# EAGLE schematic Reaktionstester_SCH (EAGLE 9.5.0)
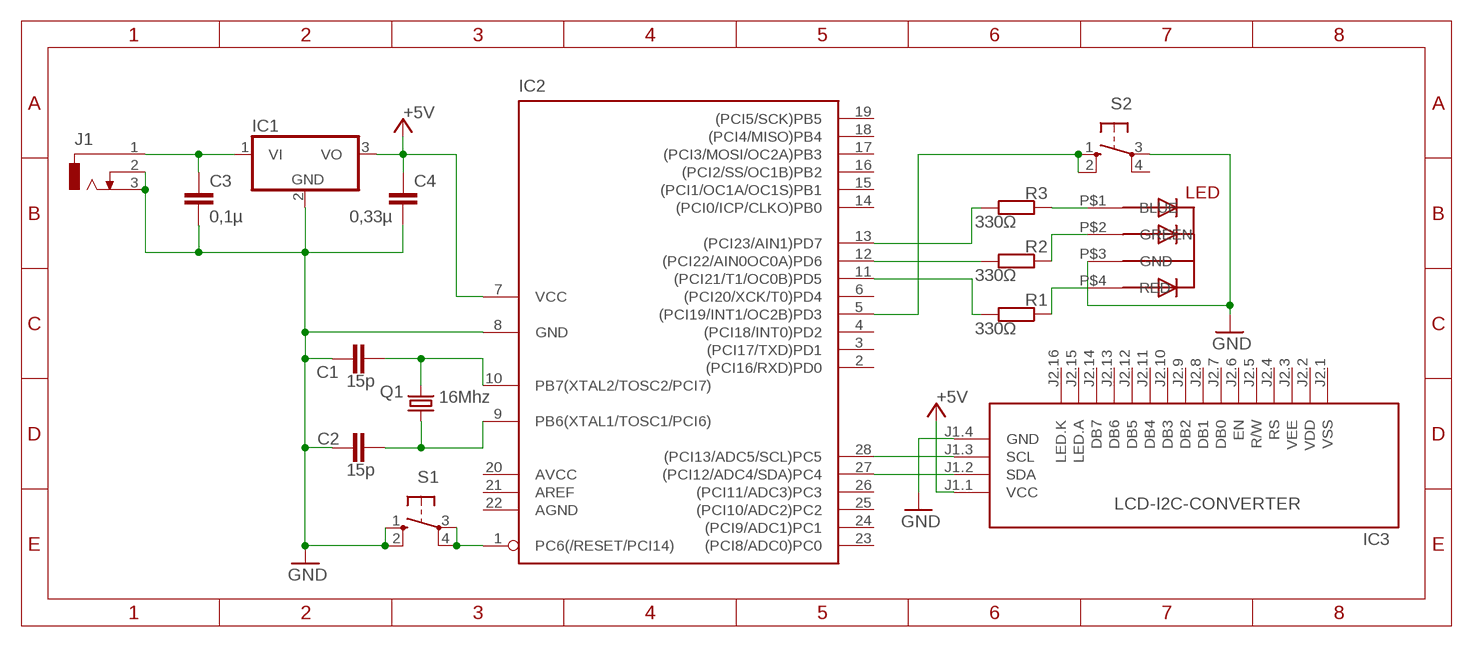
[diagram p0: schematic, sheet 1]

## Parts
C1  15p  C5/3.5  [C5B3.5]
C2  15p  C5/3.5  [C5B3.5]
C3  0,1µ  C-EU025-024X044  [C025-024X044]
C4  0,33µ  C-EU025-024X044  [C025-024X044]
IC1  7805T  [TO220H]
IC2  ATMEGA328-20P  [DIL28-3]
IC3  LCD-I2C-CONVERTER  [LCD-I2C-CONVERTER]
J1  DCJ0202  [DCJ0202]
LED  5MMRGBLED  [LED5MMRGB]
Q1  16Mhz  KX-K  [11.4X4.5]
R1  330Ω  R-EU_0204/5  [0204/5]
R2  330Ω  R-EU_0204/5  [0204/5]
R3  330Ω  R-EU_0204/5  [0204/5]
S1  10-XX  [B3F-10XX]
S2  10-XX  [B3F-10XX]

## Nets
+5V: C4.1 IC1.3(VO) IC2.7(VCC) IC3.J1.1(VCC)
GND: C1.1 C2.1 C3.2 C4.2 IC1.2(GND) IC2.8(GND) IC3.J1.4(GND) J1.2 J1.3 LED.P$3(GND) S1.1(S) S1.2(S1) S2.3(P) S2.4(P1)
N$1: C1.2 IC2.10(PB7(XTAL2/TOSC2/PCI7)) Q1.2
N$2: LED.P$1(BLUE) R3.1
N$3: C2.2 IC2.9(PB6(XTAL1/TOSC1/PCI6)) Q1.1
N$4: IC2.11((PCI21/T1/OC0B)PD5) R1.2
N$5: IC2.5((PCI19/INT1/OC2B)PD3) S2.1(S) S2.2(S1)
N$6: IC2.12((PCI22/AIN0OC0A)PD6) R2.2
N$7: IC2.13((PCI23/AIN1)PD7) R3.2
N$8: C3.1 IC1.1(VI) J1.1
N$9: LED.P$2(GREEN) R2.1
N$10: LED.P$4(RED) R1.1
N$11: IC2.28((PCI13/ADC5/SCL)PC5) IC3.J1.3(SCL)
N$12: IC2.1(PC6(/RESET/PCI14)) S1.3(P) S1.4(P1)
N$17: IC2.27((PCI12/ADC4/SDA)PC4) IC3.J1.2(SDA)
Unconnected: IC2.2((PCI16/RXD)PD0) IC2.3((PCI17/TXD)PD1) IC2.4((PCI18/INT0)PD2) IC2.6((PCI20/XCK/T0)PD4) IC2.14((PCI0/ICP/CLKO)PB0) IC2.15((PCI1/OC1A/OC1S)PB1) IC2.16((PCI2/SS/OC1B)PB2) IC2.17((PCI3/MOSI/OC2A)PB3) IC2.18((PCI4/MISO)PB4) IC2.19((PCI5/SCK)PB5) IC2.20(AVCC) IC2.21(AREF) IC2.22(AGND) IC2.23((PCI8/ADC0)PC0) IC2.24((PCI9/ADC1)PC1) IC2.25((PCI10/ADC2)PC2) IC2.26((PCI11/ADC3)PC3) IC3.J2.1(VSS) IC3.J2.2(VDD) IC3.J2.3(VEE) IC3.J2.4(RS) IC3.J2.5(R/W) IC3.J2.6(EN) IC3.J2.7(DB0) IC3.J2.8(DB1) IC3.J2.9(DB2) IC3.J2.10(DB3) IC3.J2.11(DB4) IC3.J2.12(DB5) IC3.J2.13(DB6) IC3.J2.14(DB7) IC3.J2.15(LED.A) IC3.J2.16(LED.K)

## Library data of the parts
C1 C2 = capacitor-wima:C: CAPACITOR naming: grid - package width
C3 C4 = rcl:C-EU: CAPACITOR, European symbol; SPICEPREFIX: C
IC1 = linear:78*: Positive VOLTAGE REGULATOR Source: http://cache.national.com/ds/LM/LM78L05.pdf http://www.fairchildsemi.com/ds/LM/LM7805.pdf
IC2 = atmega328:ATMEGA328*P: MICROCONTROLLER 32 kBytes FLASH 2 kBytes SRAM 1 kBytes EEPROM USART 8-channel 10 bit ADC
IC3 = diy-modules:LCD-I2C-CONVERTER: I2C Bus to 4-Bit Parallel LCD Interface with LED backlight driver
J1 = con-jack:DCJ0202: DC POWER JACK Source: DCJ0202.pdf; OC_FARNELL: unknown; OC_NEWARK: unknown
LED = led_rgb:5MMRGBLED
Q1 = crystal-geyer_V1_0:KX: Quartz Crystals (MHz) SMD: KX - Serie Model Size l/w/h [mm] Frequency Range Frequency Stability Temp. Range [°C] Load Capacitance AECQ 200 availabel Datasheet KX-4 KX-5 KX-6 KX-7 KX-9A KX-9B KX-12A KX-12B KX-13 KX-20 KX-K KX-KS 1.6/1.2/0.3 2.0/1.6/0.45 2.5/2.0/0.55 3.2/2.5/0.8 5.0/3.2/1.0 5.0/3.2/1.1 6.0/3.5/1.1 6.0/3.5/1.0 7.0/5.0 /1.3 11.6/5.5/1.6 12.3/4.5/4.2 12.3/4.5/3.2 24.0 ~ 80.0 MHz 16.0 ~ 80.0 MHz 12.0 ~ 80.0 MHz 8.0 ~ 60.0 MHz 7,68 ~ 300,0 MHz 8,0 ~ 50,0 MHz 8,0 ~ 150,0 MHz 8,0 ~ 50,0 MHz 6,0 ~ 160,0 MHz 3,579 ~ 25,0 MHz 3,579 ~ 70,0 MHz 3,579 ~ 70,0 MHz ±10 … ±50ppm ±10 … ±50ppm ±10 … ±50ppm ±10 … ±50ppm ±10 … ±50ppm ±10 … ±50ppm ±10 … ±50ppm ±10 … ±50ppm ±10 … ±50ppm ±50ppm ±10 … ±50ppm ±10 … ±50ppm (*) -40°C …+85°C (*) -40°C …+125°C (*) -40°C …+125°C (*) -40°C …+125°C (*) -40°C …+105°C (*) -40°C …+105°C (*) -40°C …+125°C (*) -40°C …+105°C (*) -40°C …+105°C (*) -40°C …+105°C (*) -40°C …+85°C (*) -40°C …+85°C 8, 8…16 8, 8…16 10, 8…16 12, 7…20 16, 10…20 16, 10…20 16, 10…20 16, 12…20 16, 12…20 16, 12…20 16, 12…30 16, 12…30 - yes yes yes - - - - - - - - KX-4.pdf <http://www.geyer-electronic.de/uploads/tx_userartikelfrequenz/GEYER-KX-4.pdf> KX-5.pdf <http://www.geyer-electronic.de/uploads/tx_userartikelfrequenz/GEYER-KX-5.pdf> KX-6.pdf <http://www.geyer-electronic.de/uploads/tx_userartikelfrequenz/GEYER-KX-6.pdf> KX-7.pdf <http://www.geyer-electronic.de/uploads/tx_userartikelfrequenz/GEYER-KX-7.pdf> KX-9A.pdf <http://www.geyer-electronic.de/uploads/tx_userartikelfrequenz/GEYER-KX-9A.pdf> KX-9B.pdf <http://www.geyer-electronic.de/uploads/tx_userartikelfrequenz/GEYER-KX-9B.pdf> KX-12A.pdf <http://www.geyer-electronic.de/uploads/tx_userartikelfrequenz/GEYER-KX-12A.pdf> KX-12B.pdf <http://www.geyer-electronic.de/uploads/tx_userartikelfrequenz/GEYER-KX-12B.pdf> KX-13.pdf <http://www.geyer-electronic.de/uploads/tx_userartikelfrequenz/GEYER-KX-13.pdf> KX-20.pdf <http://www.geyer-electronic.de/uploads/tx_userartikelfrequenz/GEYER-KX-20.pdf> KX-K.pdf <http://www.geyer-electronic.de/uploads/tx_userartikelfrequenz/GEYER-KX-K.pdf> KX-KS.pdf <http://www.geyer-electronic.de/uploads/tx_userartikelfrequenz/GEYER-KX-KS.pdf> <http://www.geyer-electronic.de/fileadmin/template/img/logo-geyer-electronic.png> Details see: http://www.geyer-electronic.de/Frequenz-Produkte.9.0.html Created 2016-06-07, Hans Locher 2016 (C) Geyer Quartz Technology KX4,KX5,KX6,KX7,KX9A,KX9B,KX12A,KX12B,KX13,KX20,KXK,KXKS;1612;2016;2520;3225;5032;6035;7050;11655;12345;1,6x1,2;2,0x1,6;2,5x2,0;3,2x2,5;5,0x3,2;6,0x3,5;7,0x5,0;11,6x5,5;12,3x4,5;12,3x4,5;1.6x1.2;2.0x1.6;2.5x2.0;3.2x2.5;5.0x3.2;6.0x3.5;7.0x5.0;11.6x5.5;12.3x4.5;12.3x4.5;
R1-R3 = rcl:R-EU_: RESISTOR, European symbol; SPICEPREFIX: R
S1 S2 = switch-omron:10-XX: OMRON SWITCH; MPN: B3F-1000; OC_FARNELL: 176432; OC_NEWARK: 36M3542